# EAGLE design expansion_module_audio_line_out (EAGLE 9.6.2)
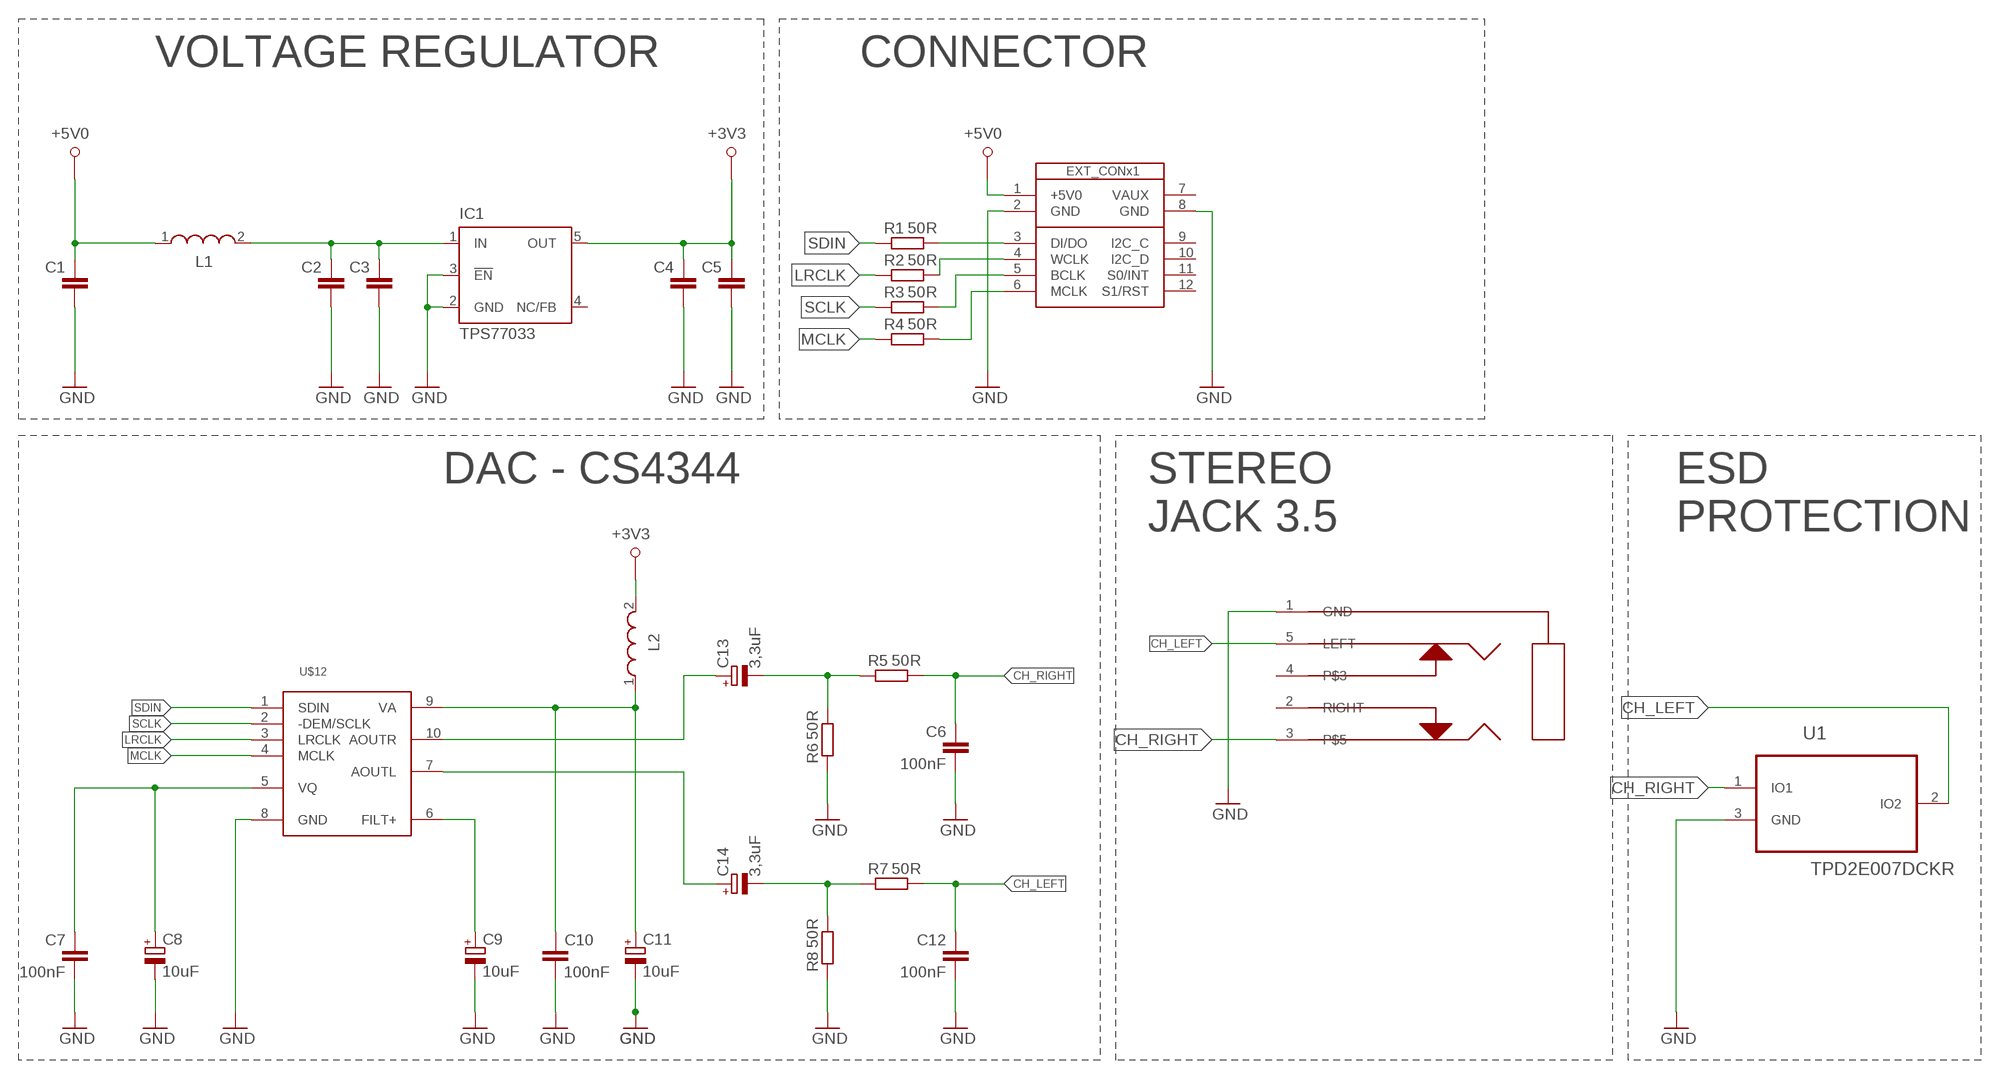
[diagram p0: schematic, sheet 1]

## Parts
C1  C-EUC0805  [C0805]
C2  C-EUC0805  [C0805]
C3  C-EUC0805  [C0805]
C4  C-EUC0805  [C0805]
C5  C-EUC0805  [C0805]
C6  100nF  C-EUC0805  [C0805]
C7  100nF  C-EUC0805  [C0805]
C8  10uF  CPOL-EUSMCA  [SMC_A]
C9  10uF  CPOL-EUSMCA  [SMC_A]
C10  100nF  C-EUC0805  [C0805]
C11  10uF  CPOL-EUSMCA  [SMC_A]
C12  100nF  C-EUC0805  [C0805]
C13  3,3uF  CPOL-EUSMCA  [SMC_A]
C14  3,3uF  CPOL-EUSMCA  [SMC_A]
IC1  TPS77033  [SOT23-DBV]
L1  WE-LQ_1210  [WE-LQ_M]
L2  WE-LQ_1210  [WE-LQ_M]
R1  50R  R-EU_R0805  [R0805]
R2  50R  R-EU_R0805  [R0805]
R3  50R  R-EU_R0805  [R0805]
R4  50R  R-EU_R0805  [R0805]
R5  50R  R-EU_R0805  [R0805]
R6  50R  R-EU_R0805  [R0805]
R7  50R  R-EU_R0805  [R0805]
R8  50R  R-EU_R0805  [R0805]
U1  TPD2E007DCKR  [SOT65P210X110-3N]
U$1  SB_EXT_CON_X1_I2S  [SB_EXT_CON_X1_FULL]
U$12  CS4344  [MSOP10]
U$27  JACK_STEREO_5_PIN  [JACK_STEREO_5_PIN]

## Nets
+3V3: C4.2 C5.2 IC1.5(OUT) L2.2
+5V0: C1.2 L1.1 U$1.1(+5V0)
CH_LEFT: C12.2 R7.2 U1.2(IO2) U$27.5(LEFT)
CH_RIGHT: C6.2 R5.2 U1.1(IO1) U$27.3
GND: C1.1 C2.1 C3.1 C4.1 C5.1 C6.1 C7.1 C8.- C9.- C10.1 C11.- C12.1 IC1.2(GND) IC1.3(!EN) R6.1 R8.1 U1.3(GND) U$1.2(GND) U$1.8(GND) U$12.8(GND) U$27.1(GND)
LRCLK: R2.1 U$12.3(LRCLK)
MCLK: R4.1 U$12.4(MCLK)
N$1: R1.2 U$1.3(DI/DO)
N$2: R2.2 U$1.4(WCLK)
N$3: R3.2 U$1.5(BCLK)
N$4: R4.2 U$1.6(MCLK)
N$5: C9.+ U$12.6(FILT+)
N$6: C7.2 C8.+ U$12.5(VQ)
N$7: C10.2 C11.+ L2.1 U$12.9(VA)
N$8: C2.2 C3.2 IC1.1(IN) L1.2
N$9: C14.- R7.1 R8.2
N$11: C13.+ U$12.10(AOUTR)
N$12: C13.- R5.1 R6.2
N$13: C14.+ U$12.7(AOUTL)
SCLK: R3.1 U$12.2(-DEM/SCLK)
SDIN: R1.1 U$12.1(SDIN)
Unconnected: IC1.4(NC/FB) U$1.7(VAUX) U$1.9(I2C_C) U$1.10(I2C_D) U$1.11(S0/INT) U$1.12(S1/RST) U$27.2(RIGHT) U$27.4

## Notes on the sheet
- VOLTAGE REGULATOR | CONNECTOR
- DAC - CS4344
- STEREO
  JACK 3.5
- ESD 
  PROTECTION

## Library data of the parts
C1-C7 C10 C12 = resistor:C-EU: CAPACITOR, European symbol
C8 C9 C11 C13 C14 = eagle_resistor:CPOL-EU: POLARIZED CAPACITOR, European symbol
IC1 = texas:TPS770*: ULTRALOW-POWER 50-mA LOW-DROPOUT LINEAR REGULATORS 50-mA Low-Dropout Regulator Source: http://focus.ti.com/lit/ds/symlink/tps77001.pdf; MF: TEXAS INSTRUMENTS; MPN: TPS77033DBVT; OC_FARNELL: 8461570; OC_NEWARK: 77C1187
L1 L2 = EagleLibrary_Wuerth_Elektronik_eiSos_rev16a:WE-LQ: SMD Inductor Characteristics Miniature chip inductor wound on a special ferrite core Small inductances for compact circuits High Q at high frequencies Low DC-resistance Operating temperature: –40 ºC to +125 ºC Applications Low power DC/DC-converters from Linear Technology, National Semiconductor, Texas Instruments, Fairchild Semiconductor, ON Semiconductor, STMicroelectronics, Maxim, MPS, Semtech, Exar, Analogic Tech, Diodes and Cologne Chip EMI-Filtering RF-circuits <http://katalog.we-online.de/media/images/eisos/IndLQ_pf2.jpg> Details see: http://katalog.we-online.de/en/pbs/WE-LQ? Updated by Dan Xu 2014-07-08 2014 (C) Wurth Elektronik
R1-R8 = resistor:R-EU_: RESISTOR, European symbol
U1 = Texas Instruments_By_element14_Batch_1:TPD2E007DCKR: 2-CHANNEL ESD-PROTECTION ARRAY FOR AC-COUPLED/NEGATIVE-RAIL DATA INTERFACES; MPN: TPD2E007DCKR; OC_FARNELL: -; OC_NEWARK: 55R7554; PACKAGE: S070-3; SUPPLIER: Texas Instruments
U$1 = al_smartboard:SB_EXT_CON_X1_I2S
U$12 = cirrus-3:CS4344
U$27 = a_jack_3.5mm_5pin:JACK_STEREO_5_PIN

## Net classes
0 default: clearance 0.205 mm

## Board
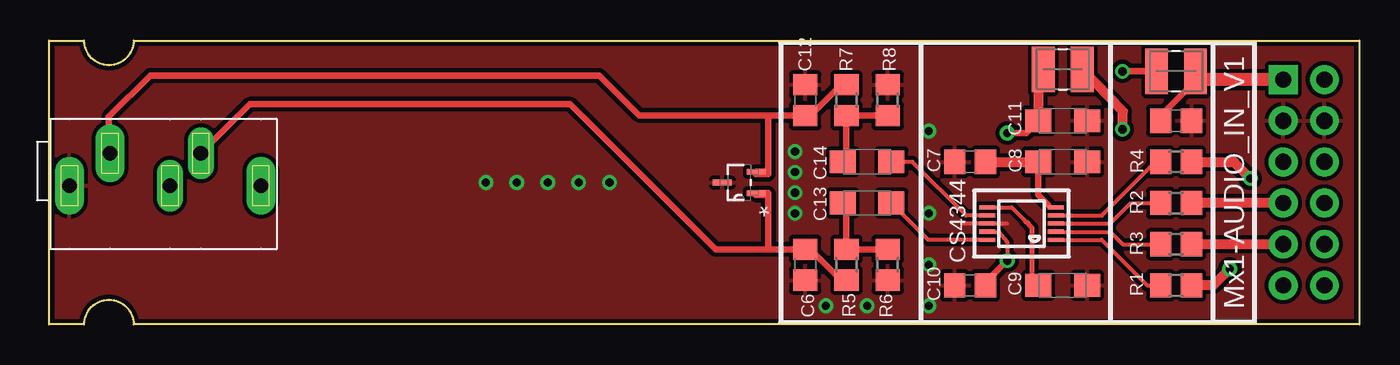
[diagram p1: board, top side]
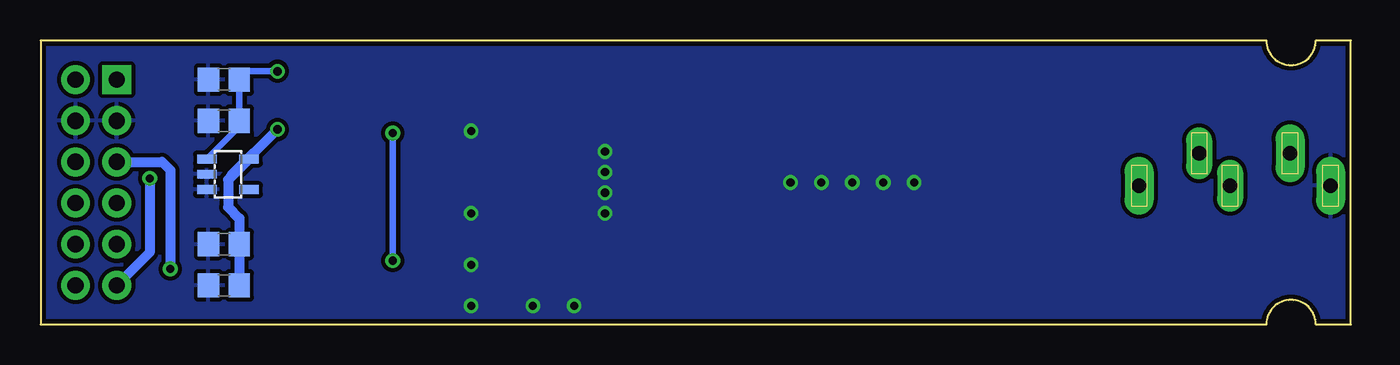
[diagram p2: board, bottom side, seen from below]

Size 80.77 x 17.53 mm. Coordinates in mm from the lower left corner, seen from the top.
Copper layers (1*16): Top 0.035mm / dielectric 1.5mm / Bottom 0.035mm
Design rules "default *": minimum track width 10mil, minimum drill 24mil, track to track 8mil, track to pad 8mil, pad to pad 8mil, via to via 8mil, smd to smd 8mil, copper to edge 10mil, drill to drill 20mil, minimum pad ring 10mil, minimum via ring 8mil, stop-mask expansion 4mil, vias tented up to drill 30mil, thermal gap 10mil

### Footprints (pad centres in the part's own frame; a part is rotated, then mirrored left to right if it is on the bottom)
C0805 = smd 1.3 x 1.5: 1 -0.95,0; 2 0.95,0
SMC_A = smd 1.6 x 1.4: + -1.5,0; - 1.5,0
SOT23-DBV = smd 0.55 x 1.2: 1 -0.95,-1.3; 2 0,-1.3; 3 0.95,-1.3; 4 0.95,1.3; 5 -0.95,1.3
WE-LQ_M = smd 1.4 x 2.8: 1 -1.2,0; 2 1.2,0
R0805 = smd 1.3 x 1.5: 1 -0.95,0; 2 0.95,0
SOT65P210X110-3N = smd 1.168 x 0.356: 1 -1.041,0.66; 2 -1.041,-0.66; 3 1.041,0
SB_EXT_CON_X1_FULL = drill 1 pad 1.778 square: 1 15.24,5.08 | drill 1 pad 1.778: 2 12.7,5.08; 3 10.16,5.08; 4 7.62,5.08; 5 5.08,5.08; 6 2.54,5.08; 7 15.24,2.54; 8 12.7,2.54; 9 10.16,2.54; 10 7.62,2.54; 11 5.08,2.54; 12 2.54,2.54
MSOP10 = smd 0.25 x 1: 1 -1,-2.113; 2 -0.5,-2.113; 3 0,-2.113; 4 0.5,-2.113; 5 1,-2.113; 6 1,2.113; 7 0.5,2.113; 8 0,2.113; 9 -0.5,2.113; 10 -1,2.113
JACK_STEREO_5_PIN = drill 0.9 pad 1.778 long: 1 1.195,-4.11; 4 12.995,-4.11; 5 3.695,-2.11 | drill 0.9 pad 1.6 long: 2 7.395,-4.11; 3 9.295,-2.11

### Placement (x,y rotation side)
C1  69.47,12.57 180 top
C2  69.47,15.11 0 bottom
C3  69.47,12.57 0 bottom
C4  69.47,2.41 0 bottom
C5  69.47,4.95 0 bottom
C6  46.61,3.68 90 top
C7  56.77,10.03 0 top
C8  62.48,10.03 0 top
C9  62.48,2.41 0 top
C10  56.77,2.41 0 top
C11  62.48,12.57 0 top
C12  46.61,13.84 270 top
C13  50.42,7.49 180 top
C14  50.42,10.03 180 top
IC1  69.22,9.27 270 bottom
L1  69.47,15.62 180 top
L2  62.48,15.75 0 top
R1  69.47,2.41 0 top
R2  69.47,7.49 0 top
R3  69.47,4.95 0 top
R4  69.47,10.03 0 top
R5  49.15,3.68 270 top
R6  51.69,3.68 90 top
R7  49.15,13.84 90 top
R8  51.69,13.84 270 top
U1  42.55,8.76 180 top
U$1  81.15,-0.13 90 top
U$12  59.94,6.22 90 top
U$27  0.05,12.67 0 top

### Tracks (layer width: path | path; a pad name or v marks a point on that pad's centre or on a via)
+3V3  (via drill 0.5)
  Top 0.61: v66.17,12.04 66.19,13.16 L2.2 63.75,15.75
  Bottom 0.406: C5.2 68.45,4.95
  Bottom 0.61: 69.22,8.92 68.96,9.27 v66.17,12.04 | 69.22,8.92 69.22,7.24 68.52,6.54 C5.2 C4.2 | IC1.5 69.22,8.92
+5V0
  Top 0.406: C1.2 68.52,12.89 70.74,15.11 70.74,15.55 L1.1
  Top 0.813: U$1.1 71.18,15.11 L1.1
CH_LEFT
  Top 0.406: R7.2 48.83,14.79 46.93,12.89 C12.2 44.32,12.89 | 44.32,12.89 36.38,12.89 33.91,15.37 6.22,15.37 3.68,12.83 3.68,10.63 U$27.5 | U1.2 44.32,9.42 44.32,12.89
CH_RIGHT
  Top 0.406: R5.2 48.83,2.73 46.93,4.63 C6.2 44.32,4.63 | 44.32,4.63 41.09,4.63 32.13,13.59 12.37,13.59 U$27.3 | U1.1 44.32,8.1 44.32,4.63
GND  (via drill 0.5)
  Top 0.254: 59.06,6.22 U$12.8 56.26,6.22
  other vias: 54.23,11.94 54.23,6.86 54.23,3.68 54.23,1.14 50.42,1.14 47.88,1.14 45.97,6.86 45.97,8.13 45.97,9.4 45.97,10.67 34.54,8.76 32.64,8.76 30.73,8.76 28.83,8.76 26.92,8.76
  pour Top (isolate 0.254): 80.9,17.91 -0.13,17.65 -0.13,-0.13 80.92,-0.13
  pour Bottom (isolate 0.254): 81.03,17.65 81.03,-0.13 -0.13,-0.13 -0.13,17.65
LRCLK
  Top 0.254: U$12.3 65.41,6.22 66.68,7.49 R2.1
MCLK
  Top 0.254: U$12.4 64.89,6.72 67.95,9.78 68.27,9.78 R4.1
N$1  (via drill 0.5)
  Top 0.61: v72.77,3.43 71.76,2.41 R1.2
  Bottom 0.61: U$1.3 73.28,10.03 72.77,9.53 v72.77,3.43
N$2
  Top 0.61: U$1.4 R2.2
N$3
  Top 0.61: U$1.5 R3.2
N$4  (via drill 0.5)
  Top 0.61: R4.2 73.03,10.03 v74.04,9.02
  Bottom 0.61: v74.04,9.02 74.04,4.44 U$1.6
N$5
  Top 0.254: U$12.6 59.33,7.22 60.2,6.35 | 60.48,2.92 C9.+ 60.98,2.77
  Top 0.305: 60.2,6.35 60.58,5.97 60.58,2.82 C9.+
N$6
  Top 0.254: U$12.5 61.74,7.22 61.6,7.37
  Top 0.406: 61.6,7.37 60.98,7.98 C8.+
  Top 0.61: C7.2 C8.+
N$7  (via drill 0.5)
  Top 0.254: U$12.9 58.54,5.72 59.06,5.08 v59.06,3.94 59.06,3.88 C10.2
  Top 0.406: C11.+ 60.22,11.81 v59.06,11.81 | v59.06,3.94 57.72,2.6 C10.2
  Top 0.61: L2.1 60.98,15.45 C11.+
  Bottom 0.406: v59.06,11.81 v59.06,3.94
N$8  (via drill 0.5)
  Top 0.406: L1.2 v66.17,15.62
  Bottom 0.406: IC1.1 68.52,12.22 C3.2 C2.2 68.45,15.62 v66.17,15.62
N$9
  Top 0.406: R8.2 R7.1 49.15,10.03 C14.-
N$11
  Top 0.254: U$12.10 54.19,5.22 C13.+
N$12
  Top 0.406: R6.2 R5.1 49.15,7.26 C13.-
N$13
  Top 0.254: U$12.7 56.52,6.72 53.21,10.03 C14.+
N$14
  Top 0.406: 43.56,9.27 44.32,9.27 44.32,12.83
N$15
  Top 0.406: 43.56,8 44.32,8 44.32,4.7
SCLK
  Top 0.254: U$12.2 65.4,5.72 66.17,4.95 R3.1
SDIN
  Top 0.254: U$12.1 64.88,5.22 67.69,2.41 R1.1

### Text on the board
tNames: Mx1-AUDIO_IN_V1 | CS4344